# EAGLE design dac_rev0 (EAGLE 6.4)
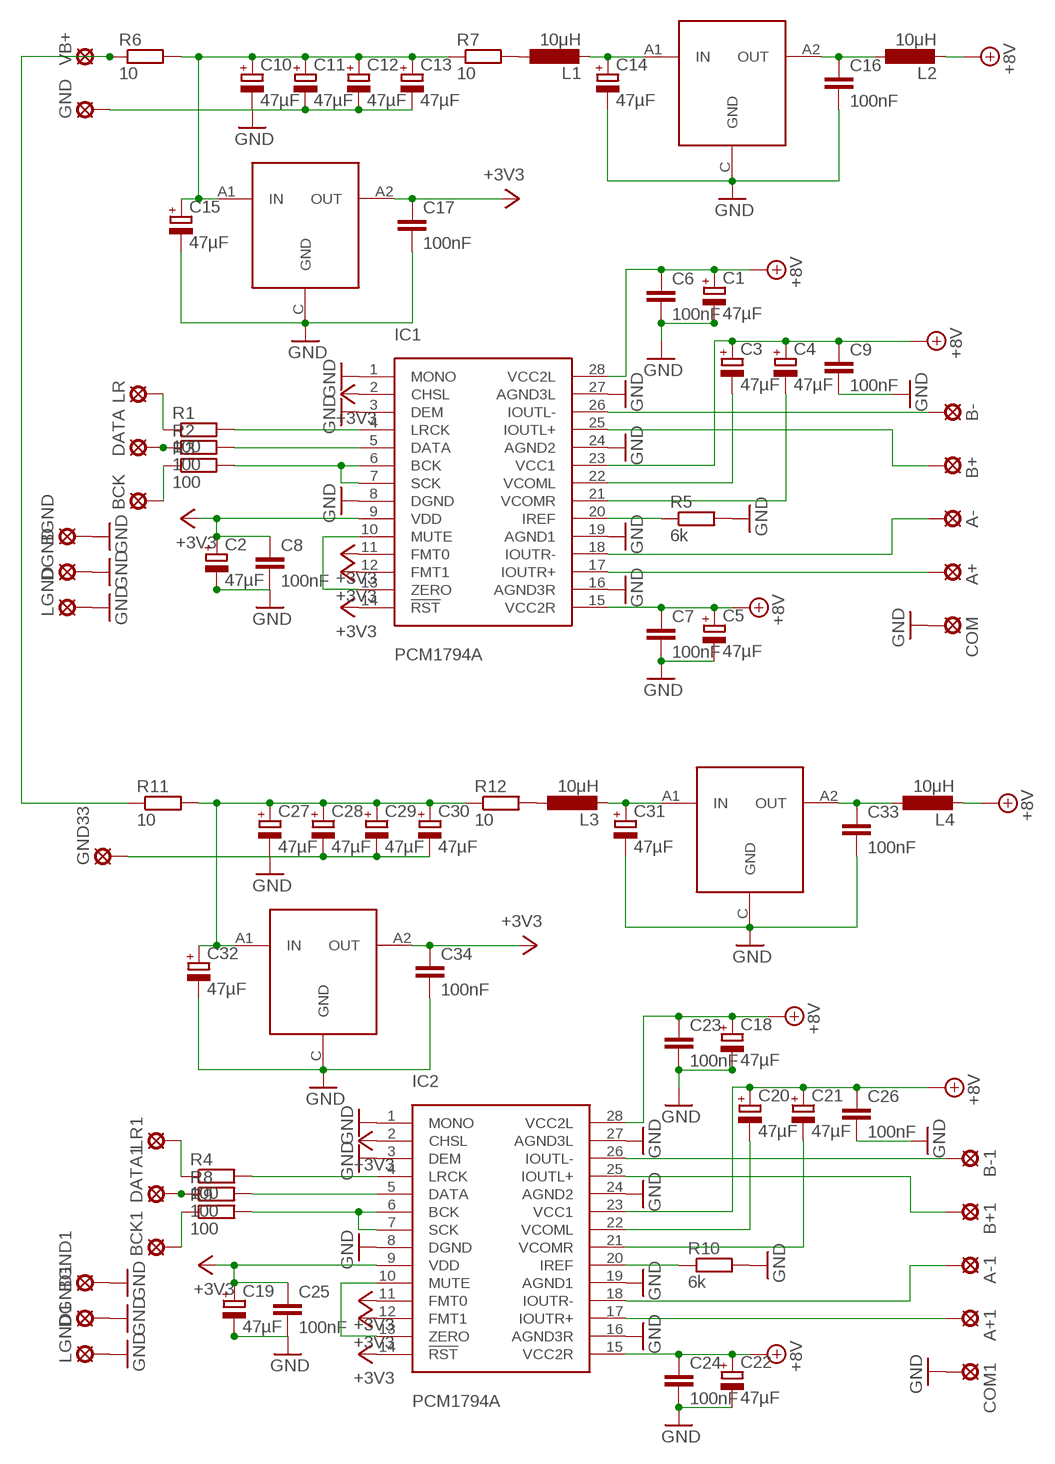
[diagram p0: schematic, sheet 1]

## Parts
A+  LSP10  [LSP10]
A+1  LSP10  [LSP10]
A-  LSP10  [LSP10]
A-1  LSP10  [LSP10]
B+  LSP10  [LSP10]
B+1  LSP10  [LSP10]
B-  LSP10  [LSP10]
B-1  LSP10  [LSP10]
BCK  LSP10  [LSP10]
BCK1  LSP10  [LSP10]
BGND  LSP10  [LSP10]
BGND1  LSP10  [LSP10]
C1  47µF  CPOL-EUE5-10.5  [E5-10,5]
C2  47µF  CPOL-EUE5-10.5  [E5-10,5]
C3  47µF  CPOL-EUE5-10.5  [E5-10,5]
C4  47µF  CPOL-EUE5-10.5  [E5-10,5]
C5  47µF  CPOL-EUE5-10.5  [E5-10,5]
C6  100nF  C-EU050-025X075  [C050-025X075]
C7  100nF  C-EU050-025X075  [C050-025X075]
C8  100nF  C-EU050-025X075  [C050-025X075]
C9  100nF  C-EU050-025X075  [C050-025X075]
C10  47µF  CPOL-EUE5-10.5  [E5-10,5]
C11  47µF  CPOL-EUE5-10.5  [E5-10,5]
C12  47µF  CPOL-EUE5-10.5  [E5-10,5]
C13  47µF  CPOL-EUE5-10.5  [E5-10,5]
C14  47µF  CPOL-EUE5-10.5  [E5-10,5]
C15  47µF  CPOL-EUE5-10.5  [E5-10,5]
C16  100nF  C-EU050-025X075  [C050-025X075]
C17  100nF  C-EU050-025X075  [C050-025X075]
C18  47µF  CPOL-EUE5-10.5  [E5-10,5]
C19  47µF  CPOL-EUE5-10.5  [E5-10,5]
C20  47µF  CPOL-EUE5-10.5  [E5-10,5]
C21  47µF  CPOL-EUE5-10.5  [E5-10,5]
C22  47µF  CPOL-EUE5-10.5  [E5-10,5]
C23  100nF  C-EU050-025X075  [C050-025X075]
C24  100nF  C-EU050-025X075  [C050-025X075]
C25  100nF  C-EU050-025X075  [C050-025X075]
C26  100nF  C-EU050-025X075  [C050-025X075]
C27  47µF  CPOL-EUE5-10.5  [E5-10,5]
C28  47µF  CPOL-EUE5-10.5  [E5-10,5]
C29  47µF  CPOL-EUE5-10.5  [E5-10,5]
C30  47µF  CPOL-EUE5-10.5  [E5-10,5]
C31  47µF  CPOL-EUE5-10.5  [E5-10,5]
C32  47µF  CPOL-EUE5-10.5  [E5-10,5]
C33  100nF  C-EU050-025X075  [C050-025X075]
C34  100nF  C-EU050-025X075  [C050-025X075]
COM  LSP10  [LSP10]
COM1  LSP10  [LSP10]
DATA  LSP10  [LSP10]
DATA1  LSP10  [LSP10]
DGND  LSP10  [LSP10]
DGND1  LSP10  [LSP10]
GND  LSP10  [LSP10]
GND33  LSP10  [LSP10]
IC1  PCM1794A  [SSOP28]
IC2  PCM1794A  [SSOP28]
L1  10μH  L-EU0207/10  [0207/10]
L2  10μH  L-EU0207/10  [0207/10]
L3  10μH  L-EU0207/10  [0207/10]
L4  10μH  L-EU0207/10  [0207/10]
LF1  LF33ABDT-TR  [DPACK_3]
LF2  LF80ABDT-TR  [DPACK_3]
LF33  LF33ABDT-TR  [DPACK_3]
LF80  LF80ABDT-TR  [DPACK_3]
LGND  LSP10  [LSP10]
LGND1  LSP10  [LSP10]
LR  LSP10  [LSP10]
LR1  LSP10  [LSP10]
R1  100  R-EU_0204/5  [0204/5]
R2  100  R-EU_0204/5  [0204/5]
R3  100  R-EU_0204/5  [0204/5]
R4  100  R-EU_0204/5  [0204/5]
R5  6k  R-EU_0204/5  [0204/5]
R6  10  R-EU_0204/7  [0204/7]
R7  10  R-EU_0204/7  [0204/7]
R8  100  R-EU_0204/5  [0204/5]
R9  100  R-EU_0204/5  [0204/5]
R10  6k  R-EU_0204/5  [0204/5]
R11  10  R-EU_0204/7  [0204/7]
R12  10  R-EU_0204/7  [0204/7]
VB+  LSP10  [LSP10]

## Nets
+3V3: C2.+ C8.1 C17.1 C19.+ C25.1 C34.1 IC1.2(CHSL) IC1.9(VDD) IC1.11(FMT0) IC1.12(FMT1) IC1.14(!RST) IC2.2(CHSL) IC2.9(VDD) IC2.11(FMT0) IC2.12(FMT1) IC2.14(!RST) LF1.A2(OUT) LF33.A2(OUT)
+8V: C1.+ C3.+ C4.+ C5.+ C6.1 C7.1 C9.1 C18.+ C20.+ C21.+ C22.+ C23.1 C24.1 C26.1 IC1.15(VCC2R) IC1.23(VCC1) IC1.28(VCC2L) IC2.15(VCC2R) IC2.23(VCC1) IC2.28(VCC2L) L2.2 L4.2
GND: BGND1.MP BGND.MP C1.- C2.- C5.- C6.2 C7.2 C8.2 C9.2 C10.- C11.- C12.- C13.- C14.- C15.- C16.2 C17.2 C18.- C19.- C22.- C23.2 C24.2 C25.2 C26.2 C27.- C28.- C29.- C30.- C31.- C32.- C33.2 C34.2 COM1.MP COM.MP DGND1.MP DGND.MP GND33.MP GND.MP IC1.1(MONO) IC1.3(DEM) IC1.8(DGND) IC1.16(AGND3R) IC1.19(AGND1) IC1.24(AGND2) IC1.27(AGND3L) IC2.1(MONO) IC2.3(DEM) IC2.8(DGND) IC2.16(AGND3R) IC2.19(AGND1) IC2.24(AGND2) IC2.27(AGND3L) LF1.C(GND) LF2.C(GND) LGND1.MP LGND.MP R5.2 R10.2
N$1: IC1.10(MUTE) IC1.13(ZERO)
N$2: BCK.MP R3.1
N$3: DATA.MP R2.1
N$4: IC1.4(LRCK) R1.2
N$5: IC1.6(BCK) IC1.7(SCK) R3.2
N$6: IC1.20(IREF) R5.1
N$7: LR.MP R1.1
N$8: IC1.5(DATA) R2.2
N$9: B-.MP IC1.26(IOUTL-)
N$10: B+.MP IC1.25(IOUTL+)
N$11: A-.MP IC1.18(IOUTR-)
N$12: A+.MP IC1.17(IOUTR+)
N$14: C3.- IC1.22(VCOML)
N$15: C4.- IC1.21(VCOMR)
N$17: C10.+ C11.+ C12.+ C13.+ C15.+ LF33.A1(IN) R6.2 R7.1
N$18: L1.1 R7.2
N$19: IC2.10(MUTE) IC2.13(ZERO)
N$20: C14.+ L1.2 LF80.A1(IN)
N$21: DATA1.MP R8.1
N$22: IC2.4(LRCK) R4.2
N$23: C16.1 L2.1 LF80.A2(OUT)
N$24: IC2.6(BCK) IC2.7(SCK) R9.2
N$25: IC2.20(IREF) R10.1
N$26: LR1.MP R4.1
N$27: B-1.MP IC2.26(IOUTL-)
N$28: B+1.MP IC2.25(IOUTL+)
N$29: A-1.MP IC2.18(IOUTR-)
N$30: A+1.MP IC2.17(IOUTR+)
N$31: C20.- IC2.22(VCOML)
N$32: C21.- IC2.21(VCOMR)
N$33: C27.+ C28.+ C29.+ C30.+ C32.+ LF1.A1(IN) R11.2 R12.1
N$34: C31.+ L3.2 LF2.A1(IN)
N$35: C33.1 L4.1 LF2.A2(OUT)
N$36: R6.1 R11.1 VB+.MP
N$37: L3.1 R12.2
N$38: BCK1.MP R9.1
N$39: IC2.5(DATA) R8.2

## Power pins joined to a net without a drawn wire
GND: LF33.C(GND) LF80.C(GND)

## Library data of the parts
A+ A+1 A- A-1 B+ B+1 B- B-1 BCK BCK1 BGND BGND1 COM COM1 DATA DATA1 DGND DGND1 GND GND33 LGND LGND1 LR LR1 VB+ = solpad:LSP10: SOLDER PAD drill 1.0 mm, distributor Buerklin, 12H555
C1-C5 C10-C15 C18-C22 C27-C32 = resistor:CPOL-EU: POLARIZED CAPACITOR, European symbol
C6-C9 C16 C17 C23-C26 C33 C34 = resistor:C-EU: CAPACITOR, European symbol
IC1 IC2 = dddac:PCM1794A: PCM1794A 132dB SNR Highest Performance Stereo DAC (H/W Control)
L1-L4 = resistor:L-EU: INDUCTOR, European symbol
LF1 LF33 = dddac:LF33ABDT-TR: LF33ABDT-TR Very low drop voltage regulator with inhibit function
LF2 LF80 = dddac:LF80ABDT-TR: LF80ABDT-TR Very low drop voltage regulator with inhibit function
R1-R12 = resistor:R-EU_: RESISTOR, European symbol

## Board
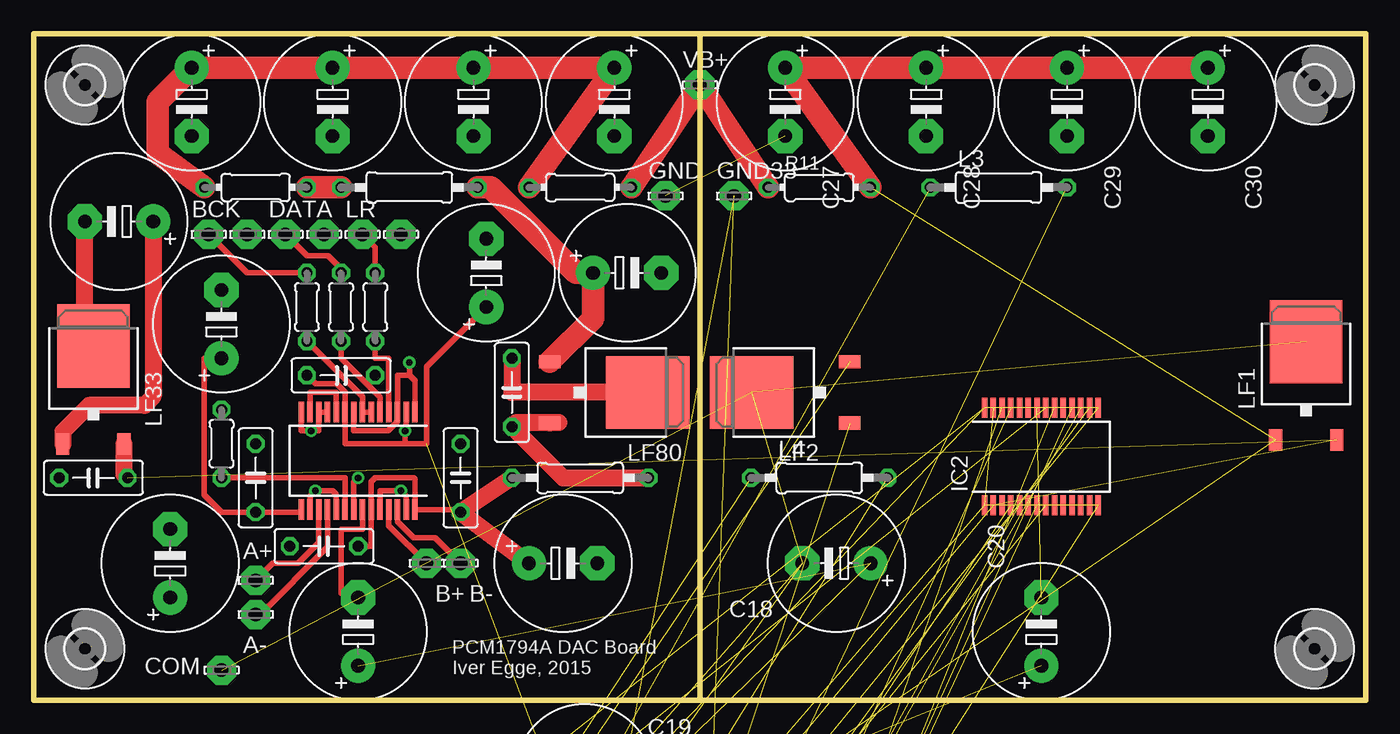
[diagram p1: board, top side]
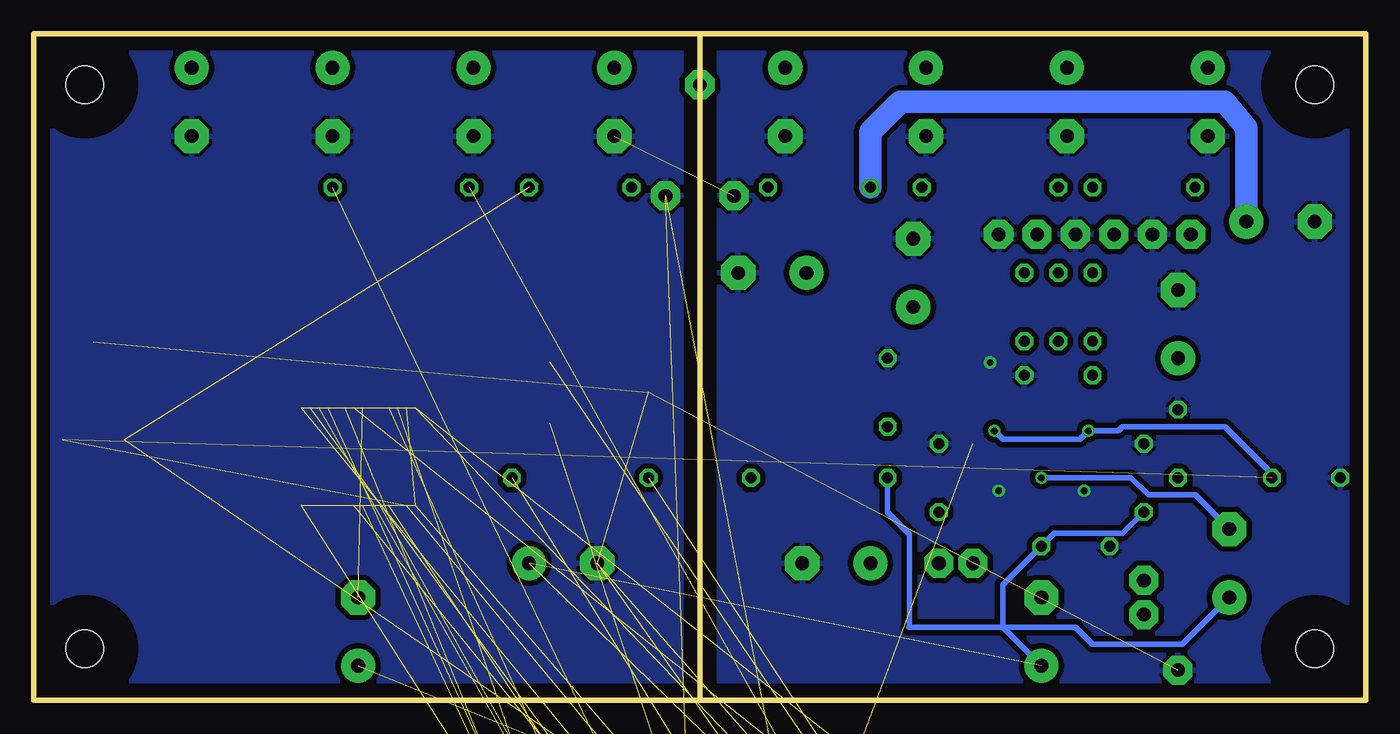
[diagram p2: board, bottom side, seen from below]

Size 99.06 x 49.53 mm. Coordinates in mm from the lower left corner, seen from the top.
Outline: 49.53,0 0,0 0,49.53 49.53,49.53
Outline: 49.53,0 99.06,0 99.06,49.53 49.53,49.53
Outline: 49.53,49.53 49.53,0
Copper layers (1*16): Top 0.035mm / dielectric 1.5mm / Bottom 0.035mm
Design rules "default": minimum track width 10mil, minimum drill 24mil, track to track 8mil, track to pad 8mil, pad to pad 8mil, via to via 8mil, smd to smd 8mil, copper to edge 40mil, drill to drill 8mil, minimum pad ring 10mil, minimum via ring 8mil, stop-mask expansion 4mil, vias tented up to drill 0mil, thermal gap 10mil

### Footprints (pad centres in the part's own frame; a part is rotated, then mirrored left to right if it is on the bottom)
LSP10 = drill 1.016 pad 2.159 octagon: MP 0,0
E5-10,5 = drill 1.016 pad 2.54: + -2.54,0 | drill 1.016 pad 2.54 octagon: - 2.54,0
C050-025X075 = drill 0.813 octagon: 1 -2.54,0; 2 2.54,0
SSOP28 = smd 0.4 x 1.5: 1 -4.225,-3.625; 2 -3.575,-3.625; 3 -2.925,-3.625; 4 -2.275,-3.625; 5 -1.625,-3.625; 6 -0.975,-3.625; 7 -0.325,-3.625; 8 0.325,-3.625; 9 0.975,-3.625; 10 1.625,-3.625; 11 2.275,-3.625; 12 2.925,-3.625; 13 3.575,-3.625; 14 4.225,-3.625; 15 4.225,3.625; 16 3.575,3.625; 17 2.925,3.625; 18 2.275,3.625; 19 1.625,3.625; 20 0.975,3.625; 21 0.325,3.625; 22 -0.325,3.625; 23 -0.975,3.625; 24 -1.625,3.625; 25 -2.275,3.625; 26 -2.925,3.625; 27 -3.575,3.625; 28 -4.225,3.625
0207/10 = drill 0.813 octagon: 1 -5.08,0; 2 5.08,0
DPACK_3 = smd 1 x 1.6: A1 -2.28,-4.8; A2 2.28,-4.8 | smd 5.4 x 6.2: C 0,2.5
0204/5 = drill 0.813 octagon: 1 -2.54,0; 2 2.54,0
0204/7 = drill 0.813 octagon: 1 -3.81,0; 2 3.81,0
2,8 = hole 2.8: 0,0

### Placement (x,y rotation side)
A+  16.51,8.89 0 top
A+1  30.48,-61.91 0 top  (outside the outline)
A-  16.51,6.35 0 top
A-1  39.37,-61.91 0 top  (outside the outline)
B+  29.21,10.16 0 top
B+1  34.92,-61.91 0 top  (outside the outline)
B-  31.75,10.16 0 top
B-1  43.18,-61.91 0 top  (outside the outline)
BCK  13.02,34.61 0 top
BCK1  14.61,-61.91 0 top  (outside the outline)
BGND  15.88,34.61 0 top
BGND1  33.97,-57.15 0 top  (outside the outline)
C1  39.37,10.16 0 top
C2  33.66,31.75 90 top
C3  24.13,5.08 90 top
C4  10.16,10.16 90 top
C5  13.97,27.94 90 top
C6  31.75,16.51 90 top
C7  16.51,16.51 90 top
C8  22.86,24.13 0 top
C9  21.59,11.43 180 top
C10  11.75,44.45 270 top
C11  22.23,44.45 270 top
C12  32.7,44.45 270 top
C13  43.18,44.45 270 top
C14  44.13,31.75 0 top
C15  6.35,35.56 180 top
C16  35.56,22.86 90 top
C17  4.45,16.51 180 top
C18  59.69,10.16 180 top
C19  40.96,-5.4 0 top  (outside the outline)
C20  74.93,5.08 90 top
C21  18.73,-21.27 0 top  (outside the outline)
C22  32.38,-21.27 0 top  (outside the outline)
C23  30.8,-40.32 0 top  (outside the outline)
C24  38.73,-40.32 0 top  (outside the outline)
C25  46.67,-40.32 0 top  (outside the outline)
C26  3.81,-50.8 0 top  (outside the outline)
C27  55.88,44.45 270 top
C28  66.36,44.45 270 top
C29  76.83,44.45 270 top
C30  87.31,44.45 270 top
C31  46.04,-31.75 0 top  (outside the outline)
C32  5.08,-42.23 0 top  (outside the outline)
C33  11.75,-50.8 0 top  (outside the outline)
C34  19.68,-50.8 0 top  (outside the outline)
COM  13.97,2.22 0 top
COM1  8.26,-61.91 0 top  (outside the outline)
DATA  18.73,34.61 0 top
DATA1  1.59,-61.91 0 top  (outside the outline)
DGND  21.59,34.61 0 top
DGND1  26.35,-57.15 0 top  (outside the outline)
GND  46.99,37.47 0 top
GND33  52.07,37.47 0 top
IC1  24.13,17.78 180 top
IC2  74.93,18.1 0 top
L1  27.94,38.1 0 top
L2  40.64,16.51 180 top
L3  71.75,38.1 0 top
L4  58.42,16.51 0 top
LF1  94.61,24.13 0 top
LF2  55.88,22.86 90 top
LF33  4.45,23.81 0 top
LF80  43.18,22.86 270 top
LGND  27.3,34.61 0 top
LGND1  48.58,-57.15 0 top  (outside the outline)
LR  24.45,34.61 0 top
LR1  26.04,-61.91 0 top  (outside the outline)
R1  25.4,29.21 270 top
R2  22.86,29.21 270 top
R3  20.32,29.21 270 top
R4  27.3,-50.16 0 top  (outside the outline)
R5  13.97,19.05 90 top
R6  40.64,38.1 180 top
R7  16.51,38.1 0 top
R8  34.61,-50.16 0 top  (outside the outline)
R9  41.91,-50.16 0 top  (outside the outline)
R10  49.21,-50.16 0 top  (outside the outline)
R11  58.42,38.1 0 top
R12  4.76,-65.72 0 top  (outside the outline)
U$3  [2,8]  3.81,3.81 0 top
U$4  [2,8]  3.81,45.72 0 top
U$5  [2,8]  95.25,45.72 0 top
U$6  [2,8]  95.25,3.81 0 top
VB+  49.53,45.72 0 top

### Tracks (layer width: path | path; a pad name or v marks a point on that pad's centre or on a via)
+3V3  (via drill 0.5)  (9 unrouted)
  Top 0.406: 27.62,19.05 29.21,19.05 29.21,24.77 C2.+ | 23.18,19.05 23.16,19.05 IC1.9 | IC1.11 IC1.12 21.2,20 v20.64,20 19.91,20 IC1.14 | C8.1 20.95,23.5 22.54,23.5 23.18,22.86 23.16,22.84 IC1.9 | IC1.9 23.16,19.39 23.18,19.37 23.18,19.05 | 23.18,19.05 27.62,19.05 | 27.62,19.05 v27.62,20 27.7,20.09 IC1.2
  Top 1.27: C17.1 6.72,16.77 LF33.A2
  Bottom 0.406: v27.62,20 26.99,19.37 21.27,19.37 v20.64,20 18.41,20 18.1,20.32 10.48,20.32 6.99,16.83 C17.1
+8V  (11 unrouted)
  Top 0.406: IC1.15 19.91,13.97 C7.1 13.97,13.97 12.7,15.24 12.7,25.4 C5.+ | C9.1 25.11,11.43 IC1.23 25.11,16.21 25.4,16.51 28.26,16.51 28.36,16.41 IC1.28 31.75,14.15 C6.1
  Top 1.27: L2.2 C6.1 C1.+
  Bottom 0.406: C3.+ 26.99,5.4 | 26.99,5.4 33.97,5.4 33.93,5.44 33.93,12.33 35.56,13.96 L2.2 | 26.99,5.4 26.99,8.57 C9.1 23.18,12.38 18.1,12.38 C7.1 | 26.99,5.4 21.59,5.4 20.32,4.13 13.65,4.13 C4.+
GND  (via drill 0.5)  (27 unrouted)
  Top 0.406: IC1.1 28.36,23.71 27.94,24.13 | 27.94,24.13 27.05,24.13 IC1.3 27.05,20.7 26.35,20 23.8,20 IC1.8 | 27.94,24.13 v27.94,25.08 | IC1.16 20.55,15.16 v20.95,15.56 22.23,15.56 22.5,15.28 IC1.19 | IC1.27 27.7,15.16 v27.3,15.56 25.75,15.56 IC1.24
  Top 1.27: LF80.C 35.56,22.86 C16.2 | LF33.C 3.81,26.95 C15.-
  pour Bottom (isolate 0.406): 0,0 49.53,0 49.53,49.53 0,49.53
  pour Bottom (isolate 0.406): 49.53,0 99.06,0 99.06,49.53 49.53,49.53
N$1
  Top 0.406: IC1.13 20.55,22.86 22.5,22.86 IC1.10
N$2
  Top 0.406: BCK.MP 15.88,31.75 R3.1
N$3
  Top 0.406: DATA.MP 20.32,33.02 21.91,33.02 22.86,32.07 R2.1
N$4
  Top 0.406: R1.2 25.4,25.4 26.41,25.4 IC1.4
N$5
  Top 0.406: R3.2 24.45,22.54 IC1.7 IC1.6
N$6
  Top 0.406: R5.1 23.16,16.51 IC1.20
N$7
  Top 0.406: LR.MP 25.4,33.66 R1.1
N$8
  Top 0.406: R2.2 22.86,25.4 25.75,22.5 IC1.5
N$9
  Top 0.406: B-.MP 29.84,12.06 28.26,12.06 27.05,13.27 IC1.26
N$10
  Top 0.406: B+.MP 26.41,12.96 IC1.25
N$11
  Top 0.406: A-.MP 16.83,6.35 21.86,11.38 IC1.18
N$12
  Top 0.406: A+.MP 17.78,10.16 19.68,10.16 21.2,11.68 IC1.17
N$14
  Top 0.406: IC1.22 24.45,12.7 22.86,12.7 22.86,7.94 24.13,7.94 C3.-
N$15  (via drill 0.5)
  Top 0.406: IC1.21 23.8,16.18 v24.13,16.51
  Bottom 0.406: v24.13,16.51 17.46,16.51 16.19,15.24 12.7,15.24 C4.-
N$16  (via drill 0.5)
  other vias: 24.13,16.51
N$17
  Top 1.27: LF33.A1 2.17,19.95 4.13,21.91 8.26,21.91 8.89,22.54 C15.+
  Top 1.676: R6.2 C13.+ C12.+ C11.+ C10.+ 9.21,44.45 9.21,40.64 R7.1
  Bottom 1.676: C15.+ 8.89,42.55 10.48,44.45 34.61,44.45 36.83,42.23 R6.2
N$18
  Top 1.676: R7.2 L1.1
N$19  (1 unrouted)
N$20
  Top 1.676: LF80.A1 41.59,28.35 C14.+ 40.32,31.75 33.97,38.1 L1.2
N$21  (1 unrouted)
N$22  (1 unrouted)
N$23
  Top 1.27: 38.44,20.64 35.88,20.64 C16.1 39.37,16.51 L2.1 | LF80.A2 38.44,20.64 | 38.44,20.64 39.05,20.64
N$24  (2 unrouted)
N$25  (1 unrouted)
N$26  (1 unrouted)
N$27  (1 unrouted)
N$28  (1 unrouted)
N$29  (1 unrouted)
N$30  (1 unrouted)
N$31  (1 unrouted)
N$32  (1 unrouted)
N$33  (4 unrouted)
  Top 1.676: C30.+ C29.+ C28.+ C27.+ R11.2
N$34  (2 unrouted)
N$35  (2 unrouted)
N$36
  Top 1.676: R6.1 VB+.MP R11.1
N$37  (1 unrouted)
N$38  (1 unrouted)
N$39  (1 unrouted)

### Text on the board
tPlace: PCM1794A DAC Board / Iver Egge, 2015